# Altium schematic sheet Leds_indication.SchDoc
size 420 x 297 mm; SheetNumber: 8; SheetTotal: 8
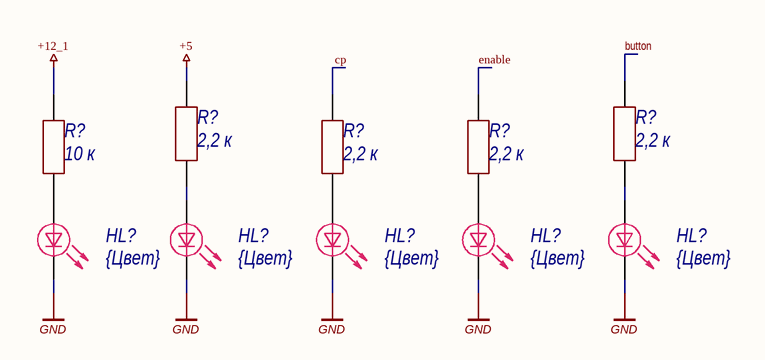
[diagram p0: Leds_indication.SchDoc]

## Parts
(Parts that share a designator on the sheet are numbered #1, #2 ... from top to bottom, then left to right.)
HL?#1  Color: {Цвет}  [0805D]  (hidden comment: LED)
HL?#2  Color: {Цвет}  [0805D]  (hidden comment: LED)
HL?#3  Color: {Цвет}  [0805D]  (hidden comment: LED)
HL?#4  Color: {Цвет}  [0805D]  (hidden comment: LED)
HL?#5  Color: {Цвет}  [0805D]  (hidden comment: LED)
R?#1  value 2,2 к  [0603R]  (hidden comment: Resistor)
R?#2  value 2,2 к  [0603R]  (hidden comment: Resistor)
R?#3  value 10 к  [0603R]  (hidden comment: Resistor)
R?#4  value 2,2 к  [0603R]  (hidden comment: Resistor)
R?#5  value 2,2 к  [0603R]  (hidden comment: Resistor)

## Nets
+5: R?#1.2
+12_1: R?#3.2
GND: HL?#1.2 HL?#2.2 HL?#3.2 HL?#4.2 HL?#5.2
button: R?#2.2
cp: R?#4.2
enable: R?#5.2
NetHL?#1_1: HL?#1.1 R?#3.1
NetHL?#2_1: HL?#2.1 R?#1.1
NetHL?#3_1: HL?#3.1 R?#4.1
NetHL?#4_1: HL?#4.1 R?#5.1
NetHL?#5_1: HL?#5.1 R?#2.1

## Notes on the sheet
- Перв. примен.
- Справ. №
- Подп. и дата
- Инв. № дубл.
- Взам. инв. №
- Инв. № подл.
- Изм.
- Лист
- № докум.
- Подп.
- Дата
- Копировал
- Формат А3

## Library data of the parts
HL?#1-HL?#5 = LED: Светодиод; Part Number: LED
R?#1 R?#2 R?#4 R?#5 = Resistor_2.2k_1_0603: Резистор номиналом 2,2 кОм и точностью 1%; Power: *; Part Number: Resistor_2.2k_1_0603; Tolerance: 1%
R?#3 = Resistor_10k_1_0603: Резистор номиналом 10 кОм и точностью 1%; Power: *; Part Number: Resistor_10k_1_0603; Tolerance: 1%